# EAGLE design MB_DoorLock (EAGLE 9.0.0)
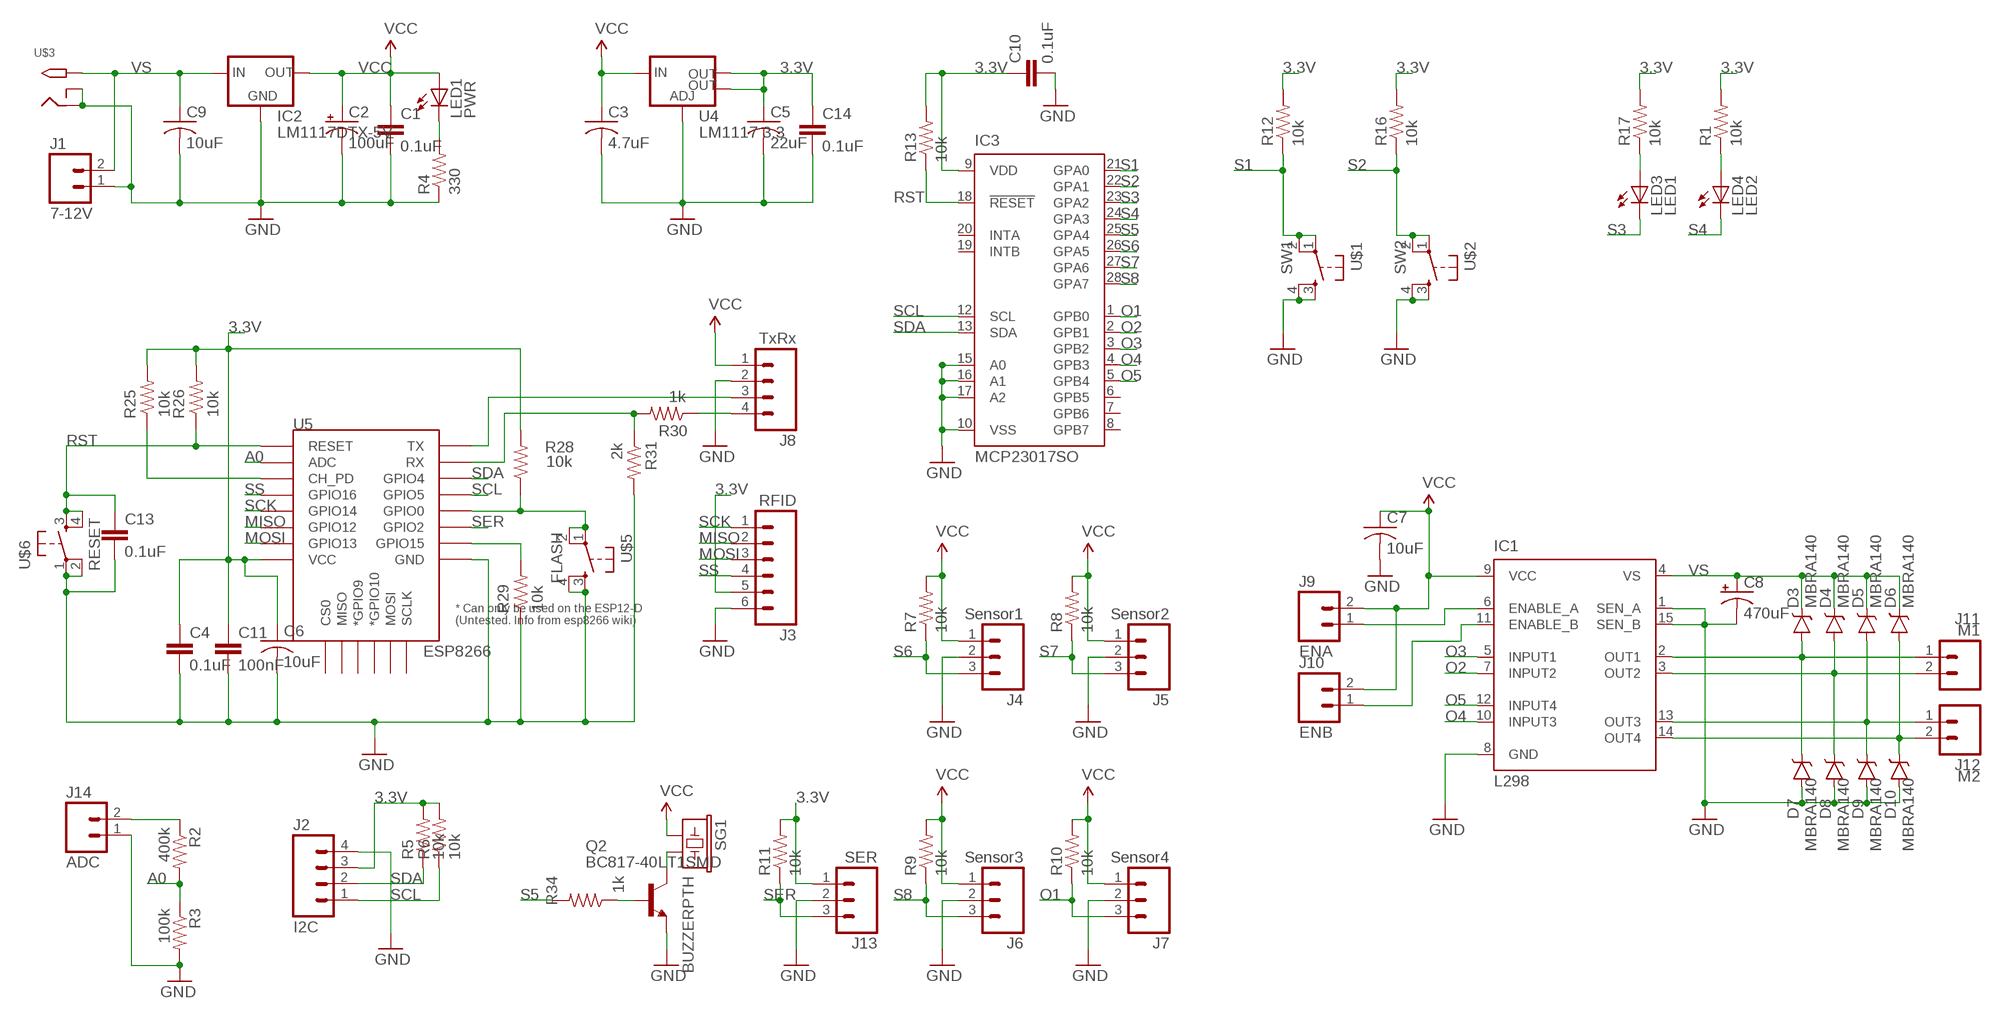
[diagram p0: schematic, sheet 1]

## Parts
C1  0.1uF  CAP0805  [0805]
C2  100uF  CAP_POL3528-KIT  [EIA3528-KIT]
C3  4.7uF  C-USC1206  [C1206]
C4  0.1uF  CAP0805  [0805]
C5  22uF  C-USC1206  [C1206]
C6  10uF  C-USC1206  [C1206]
C7  10uF  C-USC1206  [C1206]
C8  470uF  CPOL-US153CLV-1012  [153CLV-1012]
C9  10uF  C-USC1206  [C1206]
C10  0.1uF  CAP0805  [0805]
C11  100nF  CAP0805  [0805]
C13  0.1uF  CAP0805  [0805]
C14  0.1uF  CAP0805  [0805]
D3  MBRA140  [SMA-DIODE]
D4  MBRA140  [SMA-DIODE]
D5  MBRA140  [SMA-DIODE]
D6  MBRA140  [SMA-DIODE]
D7  MBRA140  [SMA-DIODE]
D8  MBRA140  [SMA-DIODE]
D9  MBRA140  [SMA-DIODE]
D10  MBRA140  [SMA-DIODE]
IC1  L298  [MULTIWATT-15]
IC2  LM1117DTX-5V  LM1117DTX-3.3  [TO252]
IC3  MCP23017SO  [SO28W]
J1  7-12V  M02POLAR  [MOLEX-1X2]
J2  I2C  M04JST-PTH-VERT  [JST-4-PTH-VERT]
J3  RFID  M06POLAR  [MOLEX-1X6]
J4  Sensor1  M03JST-PTH-VERT  [JST-3-PTH-VERT]
J5  Sensor2  M03JST-PTH-VERT  [JST-3-PTH-VERT]
J6  Sensor3  M03JST-PTH-VERT  [JST-3-PTH-VERT]
J7  Sensor4  M03JST-PTH-VERT  [JST-3-PTH-VERT]
J8  TxRx  M04POLAR  [MOLEX-1X4]
J9  ENA  M02PTH  [1X02]
J10  ENB  M02PTH  [1X02]
J11  M1  M02POLAR  [MOLEX-1X2]
J12  M2  M02POLAR  [MOLEX-1X2]
J13  SER  M03JST-PTH-VERT  [JST-3-PTH-VERT]
J14  ADC  M02POLAR  [MOLEX-1X2]
LED1  PWR  LEDCHIP-LED0805  [CHIP-LED0805]
LED3  LED1  LEDCHIP-LED0805  [CHIP-LED0805]
LED4  LED2  LEDCHIP-LED0805  [CHIP-LED0805]
Q2  BC817-40LT1SMD  [SOT23-BEC]
R1  10k  RESISTOR0805-RES  [0805]
R2  400k  RESISTOR0805-RES  [0805]
R3  100k  RESISTOR0805-RES  [0805]
R4  330  RESISTOR0805-RES  [0805]
R5  10k  RESISTOR0805-RES  [0805]
R6  10k  RESISTOR0805-RES  [0805]
R7  10k  RESISTOR0805-RES  [0805]
R8  10k  RESISTOR0805-RES  [0805]
R9  10k  RESISTOR0805-RES  [0805]
R10  10k  RESISTOR0805-RES  [0805]
R11  10k  RESISTOR0805-RES  [0805]
R12  10k  RESISTOR0805-RES  [0805]
R13  10k  RESISTOR0805-RES  [0805]
R16  10k  RESISTOR0805-RES  [0805]
R17  10k  RESISTOR0805-RES  [0805]
R25  10k  RESISTOR0805-RES  [0805]
R26  10k  RESISTOR0805-RES  [0805]
R28  10k  RESISTOR0805-RES  [0805]
R29  10k  RESISTOR0805-RES  [0805]
R30  1k  RESISTOR0805-RES  [0805]
R31  2k  RESISTOR0805-RES  [0805]
R34  1k  RESISTOR0805-RES  [0805]
SG1  BUZZERPTH  [BUZZER-12MM]
U4  LM1117 3.3  V_REG_LM1117SOT223  [SOT223]
U5  ESP8266  ESP12ESMD  [ESP12E-SMD]
U$1  SW1  TACTILE-SWITCH-PTH  [TAC-SWITCH-PTH]
U$2  SW2  TACTILE-SWITCH-PTH  [TAC-SWITCH-PTH]
U$3  7*12V  2.1MMJACK  [PJ-102A]
U$5  FLASH  TACTILE-SWITCH-PTH  [TAC-SWITCH-PTH]
U$6  RESET  TACTILE-SWITCH-PTH  [TAC-SWITCH-PTH]

## Nets
3.3V: C4.1 C5.1 C6.1 C10.1 C11.1 C14.1 IC3.9(VDD) J2.3 J3.5 J13.1 R1.2 R5.2 R6.2 R11.2 R12.2 R13.2 R16.2 R17.2 R25.2 R26.2 R28.2 U4.2(OUT) U4.4(OUT) U5.VCC
A0: R2.2 R3.1 U5.ADC
GND: C1.2 C2.C(-) C3.2 C4.2 C5.2 C6.2 C7.2 C8.- C9.2 C10.2 C11.2 C13.2 C14.2 D7.A D8.A D9.A D10.A IC1.1(SEN_A) IC1.8(GND) IC1.15(SEN_B) IC2.1(GND) IC3.10(VSS) IC3.15(A0) IC3.16(A1) IC3.17(A2) J1.1 J2.4 J3.6 J4.2 J5.2 J6.2 J7.2 J8.2 J13.2 J14.1 Q2.E R3.2 R4.1 R29.1 R31.2 U4.1(ADJ) U5.GND U$1.3 U$1.4 U$2.3 U$2.4 U$3.RING U$3.RING_SW U$5.3 U$5.4 U$6.1 U$6.2
MISO: J3.2 U5.GPIO12
MOSI: J3.3 U5.GPIO13
N$1: IC1.6(ENABLE_A) J9.1
N$2: IC1.11(ENABLE_B) J10.1
N$3: J14.2 R2.1
N$5: LED3.A R17.1
N$6: D3.A D7.C IC1.2(OUT1) J11.1
N$7: D4.A D8.C IC1.3(OUT2) J11.2
N$8: D5.A D9.C IC1.13(OUT3) J12.1
N$9: LED1.C R4.2
N$10: D6.A D10.C IC1.14(OUT4) J12.2
N$11: LED4.A R1.1
N$25: J8.4 R30.1
N$26: R30.2 R31.1 U5.RXD0(RX)
N$29: Q2.B R34.1
N$36: R25.1 U5.CH_PD
N$37: R28.1 U5.GPIO0 U$5.1 U$5.2
N$38: R29.2 U5.GPIO15
N$40: Q2.C SG1.-
N$41: J8.3 U5.TXD0(TX)
O1: IC3.1(GPB0) J7.3 R10.1
O2: IC1.7(INPUT2) IC3.2(GPB1)
O3: IC1.5(INPUT1) IC3.3(GPB2)
O4: IC1.10(INPUT3) IC3.4(GPB3)
O5: IC1.12(INPUT4) IC3.5(GPB4)
RST: C13.1 IC3.18(!RESET) R13.1 R26.1 U5.RESET U$6.3 U$6.4
S1: IC3.21(GPA0) R12.1 U$1.1 U$1.2
S2: IC3.22(GPA1) R16.1 U$2.1 U$2.2
S3: IC3.23(GPA2) LED3.C
S4: IC3.24(GPA3) LED4.C
S5: IC3.25(GPA4) R34.2
S6: IC3.26(GPA5) J4.3 R7.1
S7: IC3.27(GPA6) J5.3 R8.1
S8: IC3.28(GPA7) J6.3 R9.1
SCK: J3.1 U5.GPIO14
SCL: IC3.12(SCL) J2.1 R6.1 U5.GPIO5
SDA: IC3.13(SDA) J2.2 R5.1 U5.GPIO4
SER: J13.3 R11.1 U5.GPIO2
SS: J3.4 U5.GPIO16
VCC: C1.1 C2.A(+) C3.1 C7.1 IC1.9(VCC) IC2.TAB(OUT) J4.1 J5.1 J6.1 J7.1 J8.1 J9.2 J10.2 LED1.A R7.2 R8.2 R9.2 R10.2 SG1.+ U4.3(IN)
VS: C8.+ C9.1 D3.C D4.C D5.C D6.C IC1.4(VS) IC2.2(IN) J1.2 U$3.TIP
Unconnected: IC3.6(GPB5) IC3.7(GPB6) IC3.8(GPB7) IC3.19(INTB) IC3.20(INTA) U5.CS0 U5.GPIO9(*GPIO9) U5.GPIO10(*GPIO10) U5.MISO U5.MOSI U5.SCLK

## Library data of the parts
C1 C4 C10 C11 C13 C14 = SparkFun-Passives:CAP: Capacitor Standard 0603 ceramic capacitor, and 0.1" leaded capacitor.
C2 = SparkFun-Passives:CAP_POL: Capacitor Polarized These are standard SMD and PTH capacitors. Normally 10uF, 47uF, and 100uF in electrolytic and tantalum varieties. Always verify the external diameter of the through hole cap, it varies with capacity, voltage, and manufacturer. The EIA devices should be standard.
C3 C5-C7 C9 = adafruit:C-US: CAPACITOR, American symbol
C8 = adafruit:CPOL-US: POLARIZED CAPACITOR, American symbol
D3-D10 = SparkFun-DiscreteSemi:MBRA140: 40V, 1A Schottky rectifier SMA/DO-214AC package DIO-08053; PROD_ID: DIO-08053
IC1 = L298(new):L298: DUAL FULL-BRIDGE DRIVER
IC2 = lm1117:LM1117DTX-*
IC3 = microchip:MCP23017: http://ww1.microchip.com/downloads/en/DeviceDoc/21952a.pdf Source: http://ww1.microchip.com/downloads/en/DeviceDoc/21952a.pdf; MF: MICROCHIP; MPN: MCP23017-E/SO; OC_FARNELL: 1332087; OC_NEWARK: 31K2958
J1 J9-J12 J14 = SparkFun-Connectors:M02: Standard 2-pin 0.1" header. Use with - straight break away headers ( PRT-00116) - right angle break away headers (PRT-00553) - swiss pins (PRT-00743) - machine pins (PRT-00117) - female headers (PRT-00115) Molex polarized connector foot print use with: PRT-08233 with associated crimp pins and housings. 2.54_SCREWTERM for use with PRT-10571. 3.5mm Screw Terminal footprints for PRT-08084 5mm Screw Terminal footprints for use with PRT-08432
J2 = SparkFun-Connectors:M04: Header 4 Standard 4-pin 0.1" header. Use with straight break away headers (SKU : PRT-00116), right angle break away headers (PRT-00553), swiss pins (PRT-00743), machine pins (PRT-00117), and female headers (PRT-00115). Molex polarized connector foot print use with SKU : PRT-08231 with associated crimp pins and housings. 1MM SMD Version SKU: PRT-10208; PROD_ID: CONN-13251
J3 = SparkFun-Connectors:M06: Header 6 Standard 6-pin 0.1" header. Use with straight break away headers (SKU : PRT-00116), right angle break away headers (PRT-00553), swiss pins (PRT-00743), machine pins (PRT-00117), and female headers (PRT-00115). Molex polarized connector foot print use with SKU : PRT-08094 with associated crimp pins and housings. NOTES ON THE VARIANTS LOCK and LOCK_LONGPADS... This footprint was designed to help hold the alignment of a through-hole component (i.e. 6-pin header) while soldering it into place. You may notice that each hole has been shifted either up or down by 0.005 of an inch from it's more standard position (which is a perfectly straight line). This slight alteration caused the pins (the squares in the middle) to touch the edges of the holes. Because they are alternating, it causes a "brace" to hold the component in place. 0.005 has proven to be the perfect amount of "off-center" position when using our standard breakaway headers. Although looks a little odd when you look at the bare footprint, once you have a header in there, the alteration is very hard to notice. Also,if you push a header all the way into place, it is covered up entirely on the bottom side. This idea of altering the position of holes to aid alignment will be further integrated into the Sparkfun Library for other footprints. It can help hold any component with 3 or more connection pins.
J4-J7 J13 = ES-CONNECTOR:M03: Header 3 Standard 3-pin 0.1" header. Use with straight break away headers (SKU : PRT-00116), right angle break away headers (PRT-00553), swiss pins (PRT-00743), machine pins (PRT-00117), and female headers (PRT-00115). Molex polarized connector foot print use with SKU : PRT-08232 with associated crimp pins and housings.
J8 = SparkFun-Connectors:M04: Header 4 Standard 4-pin 0.1" header. Use with straight break away headers (SKU : PRT-00116), right angle break away headers (PRT-00553), swiss pins (PRT-00743), machine pins (PRT-00117), and female headers (PRT-00115). Molex polarized connector foot print use with SKU : PRT-08231 with associated crimp pins and housings. 1MM SMD Version SKU: PRT-10208
LED1 LED3 LED4 = adafruit:LED: LED OSRAM: - CHIPLED LG R971, LG N971, LY N971, LG Q971, LY Q971, LO R971, LY R971 LH N974, LH R974 LS Q976, LO Q976, LY Q976 LO Q996 - Hyper CHIPLED LW Q18S LB Q993, LB Q99A, LB R99A - SideLED LS A670, LO A670, LY A670, LG A670, LP A670 LB A673, LV A673, LT A673, LW A673 LH A674 LY A675 LS A676, LA A676, LO A676, LY A676, LW A676 LS A679, LY A679, LG A679 - Hyper Micro SIDELED® LS Y876, LA Y876, LO Y876, LY Y876 LT Y87S - SmartLED LW L88C, LW L88S LB L89C, LB L89S, LG L890 LS L89K, LO L89K, LY L89K LS L896, LA L896, LO L896, LY L896 - TOPLED LS T670, LO T670, LY T670, LG T670, LP T670 LSG T670, LSP T670, LSY T670, LOP T670, LYG T670 LG T671, LOG T671, LSG T671 LB T673, LV T673, LT T673, LW T673 LH T674 LS T676, LA T676, LO T676, LY T676, LB T676, LH T676, LSB T676, LW T676 LB T67C, LV T67C, LT T67C, LS T67K, LO T67K, LY T67K, LW E67C LS E67B, LA E67B, LO E67B, LY E67B, LB E67C, LV E67C, LT E67C LW T67C LS T679, LY T679, LG T679 LS T770, LO T770, LY T770, LG T770, LP T770 LB T773, LV T773, LT T773, LW T773 LH T774 LS E675, LA E675, LY E675, LS T675 LS T776, LA T776, LO T776, LY T776, LB T776 LHGB T686 LT T68C, LB T68C - Hyper Mini TOPLED® LB M676 - Mini TOPLED Santana® LG M470 LS M47K, LO M47K, LY M47K Source: http://www.osram.convergy.de/
Q2 = transistor-npn:BC817*: NPN Transistor
R1-R13 R16 R17 R25 R26 R28-R31 R34 = SparkFun-Resistors:RESISTOR: Resistor Basic schematic elements and footprints for 0603, 1206, and PTH resistors.
SG1 = SparkFun-Electromechanical:BUZZER: Buzzer 12mm Spark Fun Electronics SKU : Comp-Buzzer
U4 = SparkFun-PowerIC:V_REG_LM1117: Voltage Regulator LM1117 Standard adjustable voltage regulator but in SMD form. Spark Fun Electronics SKU : COM-00595; PROD_ID: VREG-08170
U5 = esp8266modules:ESP12E: ESP12E Module
U$1 U$2 U$5 U$6 = GeekAmmo:TACTILE-SWITCH: Tactile Switch 4 Pins, SPST NO
U$3 = adafruit:2.1MMJACK: 2.1mm x 5.5mm DC jack with internal switch. Digikey part #PJ-102A, 4UCON part #05537 By microbuilder.eu

## Board
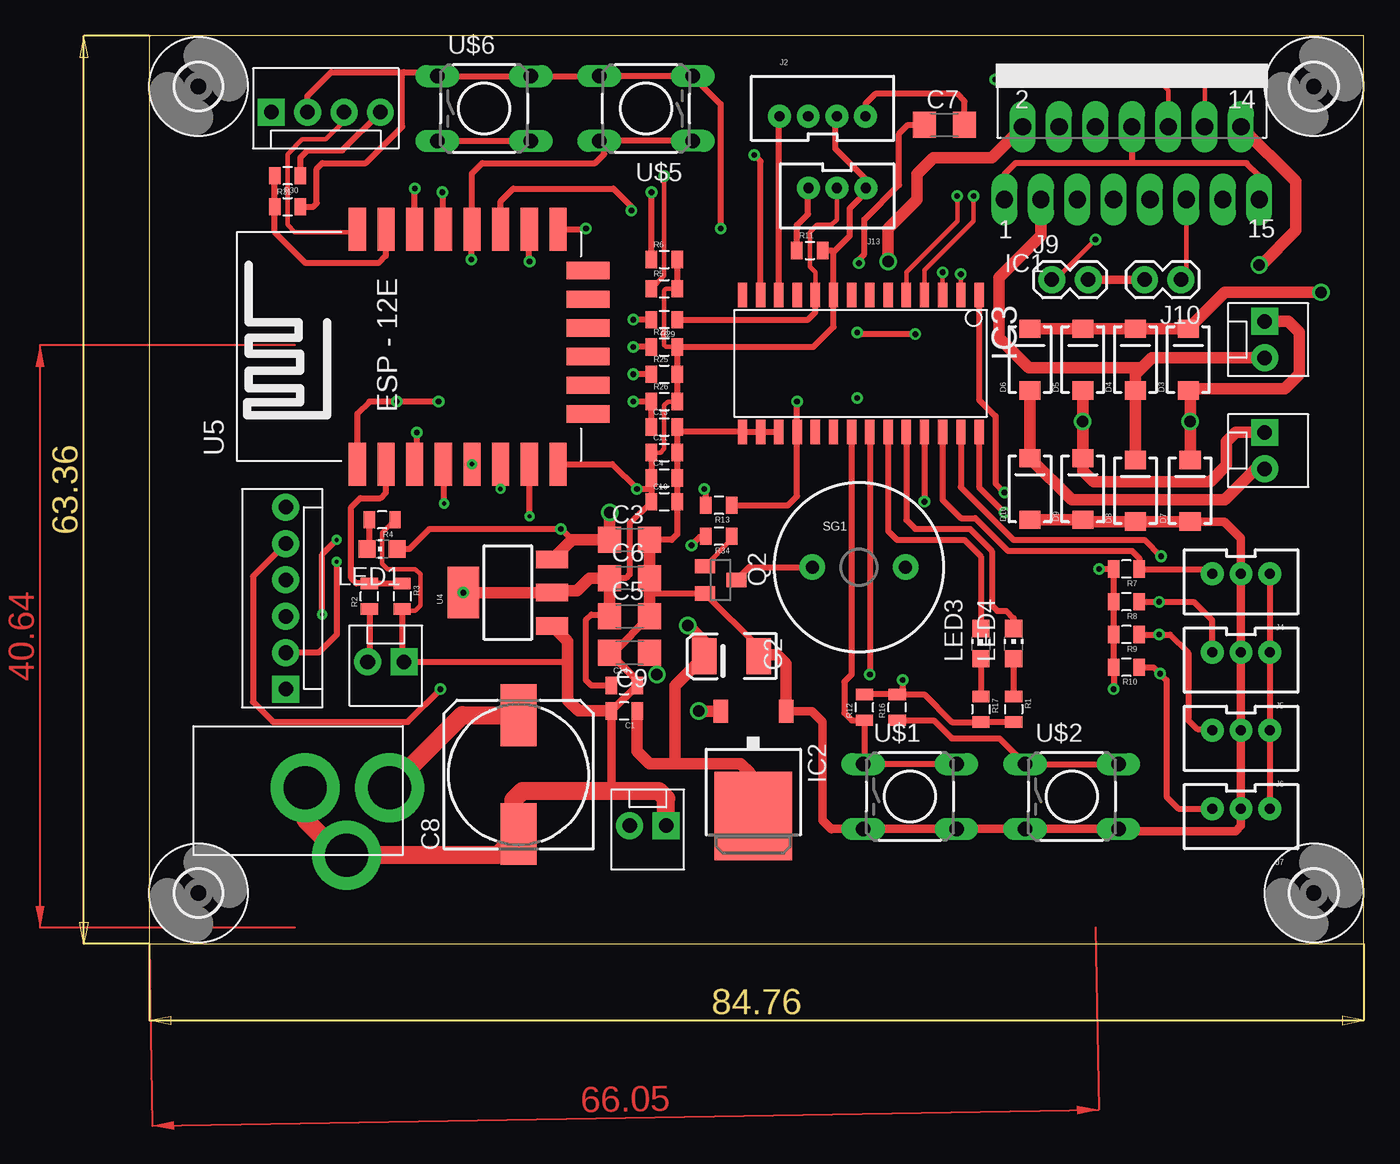
[diagram p1: board, top side]
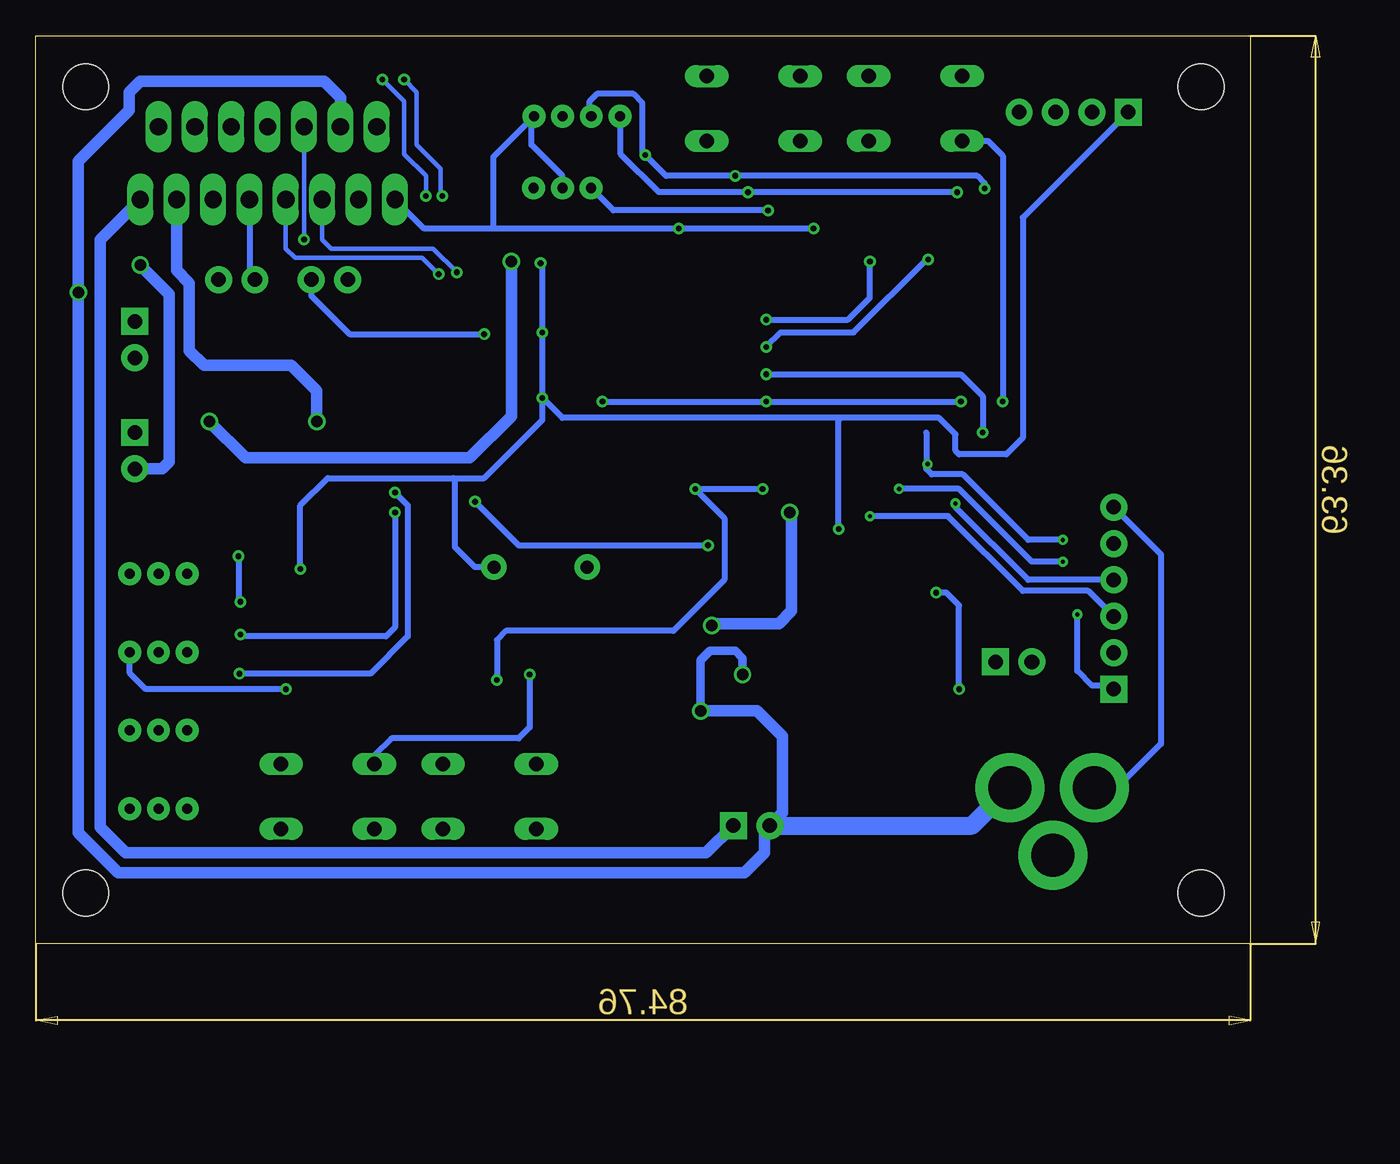
[diagram p2: board, bottom side, seen from below]

Size 84.76 x 63.36 mm. Coordinates in mm from the lower left corner, seen from the top.
Outline: 0,0 84.76,0 84.76,63.36 0,63.36 0,0
Copper layers (1*16): Top 0.035mm / dielectric 1.5mm / Bottom 0.035mm
Design rules "default *": minimum track width 6mil, minimum drill 0.35mm, track to track 6mil, track to pad 6mil, pad to pad 6mil, via to via 6mil, smd to smd 6mil, copper to edge 40mil, drill to drill 6mil, minimum pad ring 10mil, minimum via ring 8mil, stop-mask expansion 4mil, vias tented up to drill 25mil, thermal gap 10mil

### Footprints (pad centres in the part's own frame; a part is rotated, then mirrored left to right if it is on the bottom)
0805 = smd 0.8 x 1.2: 1 -0.9,0; 2 0.9,0
EIA3528-KIT = smd 1.7 x 2.5: A 1.9,0; C -1.9,0
C1206 = smd 1.6 x 1.8: 1 -1.4,0; 2 1.4,0
153CLV-1012 = smd 4.3 x 2.5: + 4.15,0; - -4.15,0
SMA-DIODE = smd 1.27 x 1.47: A -2.15,0; C 2.15,0
MULTIWATT-15 = drill 1.2 long: 1 -8.89,-7.62; 2 -7.62,-2.54; 3 -6.35,-7.62; 4 -5.08,-2.54; 5 -3.81,-7.62; 6 -2.54,-2.54; 7 -1.27,-7.62; 8 0,-2.54; 9 1.27,-7.62; 10 2.54,-2.54; 11 3.81,-7.62; 12 5.08,-2.54; 13 6.35,-7.62; 14 7.62,-2.54; 15 8.89,-7.62
TO252 = smd 1 x 1.6: 1 -2.28,-4.8; 2 2.28,-4.8 | smd 5.4 x 6.2: TAB 0,2.5
SO28W = smd 0.65 x 1.7: 1 -7.62,-4.78; 2 -6.35,-4.78; 3 -5.08,-4.78; 4 -3.81,-4.78; 5 -2.54,-4.78; 6 -1.27,-4.78; 7 0,-4.78; 8 1.27,-4.78; 9 2.54,-4.78; 10 3.81,-4.78; 11 5.08,-4.78; 12 6.35,-4.78; 13 7.62,-4.78; 14 8.89,-4.78; 15 8.89,4.78; 16 7.62,4.78; 17 6.35,4.78; 18 5.08,4.78; 19 3.81,4.78; 20 2.54,4.78; 21 1.27,4.78; 22 0,4.78; 23 -1.27,4.78; 24 -2.54,4.78; 25 -3.81,4.78; 26 -5.08,4.78; 27 -6.35,4.78; 28 -7.62,4.78
MOLEX-1X2 = drill 1.016 pad 1.88 square: 1 0,0 | drill 1.016 pad 1.88: 2 2.54,0
JST-4-PTH-VERT = drill 0.7 pad 1.6: 1 -3,-0.55; 2 -1,-0.55; 3 1,-0.55; 4 3,-0.55
MOLEX-1X6 = drill 1.016 pad 1.88 square: 1 0,0 | drill 1.016 pad 1.88: 2 2.54,0; 3 5.08,0; 4 7.62,0; 5 10.16,0; 6 12.7,0
JST-3-PTH-VERT = drill 0.7 pad 1.6: 1 -2,-0.55; 2 0,-0.55; 3 2,-0.55
MOLEX-1X4 = drill 1.016 pad 1.88 square: 1 0,0 | drill 1.016 pad 1.88: 2 2.54,0; 3 5.08,0; 4 7.62,0
1X02 = drill 1.016 pad 1.88: 1 0,0; 2 2.54,0
CHIP-LED0805 = smd 1.2 x 1.2: A 0,-1.05; C 0,1.05
SOT23-BEC = smd 1 x 1.4: B -0.95,-1.1; C 0,1.1; E 0.95,-1.1
BUZZER-12MM = drill 0.9 pad 1.778: + 3.25,0; - -3.25,0
SOT223 = smd 1.219 x 2.235: 1 -2.311,-3.099; 2 0,-3.099; 3 2.311,-3.099 | smd 3.6 x 2.2: 4 0,3.099
ESP12E-SMD = smd 3 x 1.2: ADC -8.3,3.8; CH_PD -8.3,1.8; GND 8.1,-8.2; GPIO0 8.1,-2.2; GPIO2 8.1,-4.2; GPIO4 8.1,1.8; GPIO5 8.1,-0.2; GPIO12 -8.3,-4.2; GPIO13 -8.3,-6.2; GPIO14 -8.3,-2.2; GPIO15 8.1,-6.2; GPIO16 -8.3,-0.2; RESET -8.3,5.8; RXD0 8.1,3.8; TXD0 8.1,5.8; VCC -8.3,-8.2 | smd 1.2 x 3: CS0 -4.8,-10.3; GPIO9 -0.8,-10.3; GPIO10 1.2,-10.3; MISO -2.8,-10.3; MOSI 3.2,-10.3; SCLK 5.2,-10.3
TAC-SWITCH-PTH = drill 1.016 pad 1.524 long: 1 -3.251,2.261; 2 3.251,2.261; 3 -3.251,-2.261; 4 3.251,-2.261
PJ-102A = drill 3 pad 4.8: RING 0.1,-3.39; RING_SW -4.6,-6.29; TIP 0.1,-9.29
3,2 = hole 3.2: 0,0

### Placement (x,y rotation side)
C1  33.15,16.26 180 top
C2  40.64,20.07 180 top
C3  33.53,28.19 0 top
C4  35.94,32.51 0 top
C5  33.53,22.86 0 top
C6  33.53,25.53 0 top
C7  55.5,57.15 0 top
C8  25.78,11.81 90 top
C9  33.53,20.32 180 top
C10  35.94,30.86 0 top
C11  35.94,34.29 0 top
C13  35.94,36.07 0 top
C14  33.15,18.03 0 top
D3  72.52,40.77 90 top
D4  68.83,40.77 90 top
D5  65.15,40.77 90 top
D6  61.47,40.77 90 top
D7  72.64,31.62 90 top
D8  68.83,31.62 90 top
D9  65.15,31.75 90 top
D10  61.47,31.75 90 top
IC1  68.58,59.56 0 top
IC2  42.16,11.43 180 top
IC3  50.29,40.51 180 top
J1  36.07,8.26 180 top
J2  46.99,58.29 0 top
J3  9.53,17.78 90 top
J4  76.2,25.27 180 top
J5  76.2,19.81 180 top
J6  76.2,14.35 180 top
J7  76.2,8.89 180 top
J8  8.51,58.04 0 top
J9  62.99,46.36 0 top
J10  72.01,46.36 180 top
J11  77.85,43.43 270 top
J12  77.85,35.69 270 top
J13  48.01,52.2 180 top
J14  17.78,19.68 180 top
LED1  16.26,27.56 90 top
LED3  58.04,20.95 0 top
LED4  60.33,20.95 0 top
Q2  39.88,25.4 270 top
R1  60.33,16.38 270 top
R2  15.37,24.26 90 top
R3  17.65,24.26 270 top
R4  16.26,29.59 180 top
R5  35.94,45.72 0 top
R6  35.94,47.75 0 top
R7  68.2,26.16 180 top
R8  68.2,23.88 180 top
R9  68.2,21.59 180 top
R10  68.2,19.3 180 top
R11  46.1,48.39 0 top
R12  49.91,16.51 90 top
R13  39.75,30.61 180 top
R16  52.2,16.51 90 top
R17  58.04,16.38 270 top
R25  35.94,39.75 0 top
R26  35.94,37.85 0 top
R28  35.94,41.66 0 top
R29  35.94,43.56 180 top
R30  9.65,53.59 180 top
R31  9.65,51.44 0 top
R34  39.75,28.45 180 top
SG1  49.53,26.29 0 top
U4  25.02,24.51 90 top
U5  20.32,41.78 90 top
U$1  53.09,10.29 0 top
U$2  64.39,10.29 0 top
U$3  7.49,10.79 90 top
U$4  [3,2]  3.43,3.56 0 top
U$5  34.67,58.29 180 top
U$6  23.37,58.29 0 top
U$7  [3,2]  3.43,59.82 0 top
U$8  [3,2]  81.28,59.82 0 top
U$9  [3,2]  81.28,3.56 0 top

### Tracks (layer width: path | path; a pad name or v marks a point on that pad's centre or on a via)
3.3V  (via drill 0.4)
  Top 0.305: R5.2 36.07,45.72 35.94,45.59 35.94,41.78 36.07,41.66 R28.2 | C11.1 35.69,34.29 35.94,34.54 35.94,37.59 36.2,37.85 R26.2
  Top 0.406: R1.2 R17.2 56.02,15.48 54.09,17.41 52.58,17.41 | R12.2 R16.2 52.58,17.41 | R6.2 R5.2 | R26.2 R25.2 R28.2 46.35,41.66 47.75,43.05 IC3.9 47.75,48.26 | C11.1 C4.1 35.04,31.88 | 35.04,31.88 C10.1 33.53,29.35 33.53,25.78 33.27,25.53 C6.1 | C14.1 30.86,18.03 30.48,18.41 30.48,22.61 30.86,22.99 32.13,22.99 | J2.3 47.88,57.63 47.88,55.5 50.01,53.37 J13.1 50.16,52.59 48.9,51.32 48.9,49.4 47.75,48.26 | R11.2 47.62,48.39 47.75,48.26 | R13.2 38.85,31.63 v38.73,31.75 | 35.04,31.88 34.91,31.75 v34.04,31.75 32.3,33.48 U5.VCC | J3.5 7.24,25.65 7.24,16.89 8.64,15.49 18.03,15.49 v20.32,17.78 | v52.58,18.41 52.58,17.41
  Top 0.813: C5.1 32.13,22.99 C6.1 30.73,25.53 29.84,24.64 28.25,24.64 U4.2 U4.4
  Bottom 0.406: v34.04,31.75 v38.73,31.75 36.7,29.72 36.7,25.4 40.26,21.84 51.94,21.84 52.58,21.21 v52.58,18.41 | v20.32,17.78 20.32,23.62 21.21,24.51 U4.4
  other vias: 21.92,24.51
A0
  Top 0.406: R3.1 R2.2 14.47,25.16 14.1,25.53 14.1,30.48 14.73,31.11 16.13,31.11 16.52,31.51 U5.ADC
GND  (via drill 0.4)
  Top 0.305: R4.1 16.26,28.69 16.26,26.54 16.64,26.16 18.54,26.16 18.92,25.78 18.92,23.62 18.54,23.24 17.78,23.24 17.65,23.11 | IC3.10 46.48,46.86 46.1,47.24 46.1,49.66 46.61,50.16 47.62,50.16 48.01,50.55 J13.2
  Top 0.406: 50.04,8.03 U$1.3 | U$6.1 20.32,60.55 | 20.32,60.55 U$6.2 U$5.4 U$5.3 39.88,58.6 v39.88,49.91 | J8.2 11.05,59.18 12.7,60.83 17.78,60.83 | 17.78,60.83 20.32,60.83 20.32,60.55 | R3.2 17.65,23.11 17.65,19.81 J14.1 29.21,19.68 | C13.2 36.84,35.69 | 36.84,35.69 C11.2 C4.2 C10.2 36.84,28.59 36.45,28.19 C3.2 | IC3.17 IC3.16 IC3.15 36.89,35.73 36.84,35.69 | R31.2 11.43,51.44 11.68,51.69 11.68,54.1 12.06,54.48 15.11,54.48 17.65,57.02 17.65,60.71 17.78,60.83 | 34.93,24.26 35.12,24.45 Q2.E 42.54,20.69 C2.C | R29.1 45.97,43.56 46.48,44.07 IC3.10 | U5.GND 30.45,49.88 v30.48,49.91 | IC1.15 77.47,53.59 76.58,54.48 68.58,54.48 | 68.58,54.48 60.45,54.48 59.69,53.72 IC1.1 | IC1.8 68.58,54.48 | C7.2 56.9,58.8 56.39,59.31 50.67,59.31 49.99,58.63 J2.4 | U$3.RING_SW 13.76,6.22 12.7,6.22 13.02,6.54
  Top 0.508: C5.2 32.39,20.32 C9.2 34.05,18.4 C14.2 34.02,18.03 C1.2
  Top 0.61: C1.2 32.25,11.06 32.64,10.67 | IC2.1 46.25,16.23 46.99,15.49 46.99,8.64 47.62,8 47.65,8.03 50.04,8.03 | U$1.3 U$1.4 U$2.3 U$2.4 67.79,7.87 75.82,7.87 76.2,8.26 J7.2 J6.2 J5.2 J4.2 76.2,28.32 75.05,29.47 D7.A
  Top 0.813: D7.A D8.A 65.28,29.47 D9.A D10.A | C3.2 C6.2 34.93,24.26 C5.2 | U4.1 29.21,21.11 29.21,19.68 29.21,17.02 29.97,16.26 C1.2 | IC2.1 44.44,19.56 43.81,20.19 43.18,20.19 42.55,20.83 42.54,20.82 C2.C
  Top 1.27: U$3.RING 10.88,8.68 13.02,6.54 13.34,6.22 | U$3.RING_SW 24.32,6.2 C8.- 25.4,8.04 25.4,10.03 26.04,10.67 32.64,10.67 35.56,10.67 36.07,10.16 J1.1
  Bottom 0.406: J13.2 48.01,53.59 50.16,55.75 50.16,57.57 J2.4 52.83,54.9 52.83,49.91 | v30.48,49.91 v39.88,49.91 52.83,49.91 | 52.83,49.91 57.66,49.91 IC1.1 | J3.6 6.22,27.18 6.22,13.97 9.3,10.9 U$3.RING
  Bottom 0.813: J1.1 37.97,6.35 78.49,6.35 80.26,8.13 80.26,49.15 IC1.15
MISO  (via drill 0.3)
  Top 0.406: v24.51,31.75 U5.GPIO12 | J3.2 11.81,20.32 13.08,21.59 v13.08,26.67
  Bottom 0.406: v13.08,26.67 15.24,26.67 20.32,31.75 v24.51,31.75
MOSI  (via drill 0.3)
  Top 0.406: v26.54,29.84 26.54,33.46 U5.GPIO13
  Bottom 0.406: J3.3 11.3,24.64 15.88,24.64 21.08,29.84 v26.54,29.84
N$1  (via drill 0.4)
  Top 0.305: v66.04,49.15 63.25,46.36 J9.1
  Bottom 0.305: IC1.6 v66.04,49.15
N$2
  Top 0.305: IC1.11 72.39,46.74 J10.1
N$3
  Top 0.406: R2.1 15.37,19.81 J14.2
N$5
  Top 0.406: LED3.A R17.1
N$6  (via drill 0.8)
  Top 0.813: D7.C v72.64,36.45 72.64,38.49 D3.A 72.64,38.73 79.25,38.73 80.26,39.75 80.26,42.67 79.5,43.43 J11.1 | v51.56,47.62 51.56,49.91 53.59,51.94 53.59,53.72 54.74,54.86 58.8,54.86 IC1.2
  Bottom 0.813: v51.56,47.62 51.56,36.83 54.48,33.91 70.1,33.91 v72.64,36.45
N$7
  Top 0.813: D8.C D4.A 68.83,39.75 69.28,40.2 | J11.2 69.98,40.89 69.28,40.2 | IC1.3 62.23,49.4 59.31,46.48 59.31,42.29 61.4,40.2 69.28,40.2
N$8  (via drill 0.8)
  Top 0.813: D5.A v65.15,36.45 D9.C 65.15,33.02 65.91,32.26 74.04,32.26 75.18,33.4 75.18,35.05 75.82,35.69 J12.1
  Bottom 0.813: IC1.13 74.93,46.99 74.04,46.1 74.04,41.4 73.03,40.39 66.93,40.39 D5.A v65.15,36.45
N$9
  Top 0.406: R4.2 15.36,27.71 LED1.C
N$10  (via drill 0.8)
  Top 0.813: D6.A D10.C 64.38,30.99 75.06,30.99 77.22,33.15 J12.2 | IC1.14 80.01,53.21 80.01,49.78 77.6,47.37 v77.47,47.37
  Bottom 0.813: v77.47,47.37 75.44,45.34 75.44,33.66 75.95,33.15 J12.2
N$11
  Top 0.406: LED4.A R1.1
N$25
  Top 0.406: R30.1 10.55,54.88 11.05,55.37 13.46,55.37 J8.4
N$26
  Top 0.406: R30.2 R31.1 8.75,49.67 10.92,47.5 16,47.5 16.51,48.01 U5.RXD0
N$29
  Top 0.305: Q2.B 40.65,28.22 R34.1
N$36  (via drill 0.4)
  Top 0.406: R25.1 v33.78,39.75 | v18.67,35.69 18.67,33.63 U5.CH_PD
  Bottom 0.406: v33.78,39.75 20.19,39.75 18.67,38.23 v18.67,35.69
N$37  (via drill 0.4)
  Top 0.406: U$5.1 31.75,56.03 | 31.75,56.03 U$5.2 | 31.75,56.03 31.75,55.12 31.11,54.48 23.24,54.48 22.52,53.76 U5.GPIO0 22.48,49.84 v22.48,47.75 | R28.1 v33.78,41.66
  Bottom 0.406: v33.78,41.66 32.77,42.67 27.69,42.67 22.61,47.75 v22.48,47.75
N$38  (via drill 0.4)
  Top 0.406: R29.2 v33.78,43.56 | v26.54,47.62 26.52,47.65 U5.GPIO15
  Bottom 0.406: v33.78,43.56 28.07,43.56 26.54,45.09 v26.54,47.62
N$40
  Top 0.406: Q2.C 41.87,26.29 SG1.-
N$41
  Top 0.305: J8.3 13.59,57.4 12.32,56.13 10.67,56.13 9.65,55.12 9.65,50.16 10.16,49.66 14.29,49.66
  Top 0.406: 14.29,49.66 U5.TXD0
O1  (via drill 0.4)
  Top 0.406: R10.1 70.1,19.3 v70.55,18.86 70.99,18.41 70.99,10.29 71.84,9.44 J7.3 | IC3.1 57.91,37.97 59.05,36.83 59.05,32.13 v59.69,31.5
  Bottom 0.406: v59.69,31.5 58.8,30.61 58.8,21.46 61.4,18.86 v70.55,18.86
O2  (via drill 0.4)
  Top 0.305: IC3.2 v56.64,46.74
  Bottom 0.305: v56.64,46.74 57.78,47.88 66.67,47.88 67.31,48.51 IC1.7
O3  (via drill 0.4)
  Top 0.305: IC3.3 v55.37,46.86
  Top 0.406: 64.64,51.82 IC1.5
  Bottom 0.305: v55.37,46.86 57.02,48.51 64.14,48.51 64.77,49.15 IC1.5
O4  (via drill 0.4)
  Top 0.305: IC3.4 54.1,46.99 57.53,50.42 v57.53,52.2 | v60.58,60.33 70.36,60.33 71.12,59.56 IC1.10
  Bottom 0.305: v57.53,52.2 57.53,53.59 59.05,55.12 59.05,58.8 v60.58,60.33
O5  (via drill 0.4)
  Top 0.305: IC3.5 52.83,46.86 56.39,50.42 v56.39,52.2 | v59.05,60.33 59.94,61.21 72.39,61.21 73.66,59.94 IC1.12
  Bottom 0.305: v56.39,52.2 56.52,52.32 56.52,54.1 58.17,55.75 58.17,59.44 v59.05,60.33
RST  (via drill 0.4)
  Top 0.406: U$6.3 U$6.4 | C13.1 R26.1 v33.78,37.85 | R13.1 44.58,30.61 45.21,31.24 IC3.18 v45.21,37.85 | v20.19,37.85 v17.27,37.85 15.37,37.85 14.52,37 U5.RESET
  Bottom 0.406: v20.19,37.85 v33.78,37.85 v45.21,37.85 | U$6.3 18.31,56.03 17.27,54.99 v17.27,37.85
S1
  Top 0.406: U$1.2 49.91,12.55 | 49.91,12.55 U$1.1 | 49.91,12.55 R12.1 49.03,15.61 48.51,16.13 48.51,18.29 49.02,18.8 IC3.21
S2  (via drill 0.4)
  Top 0.406: U$2.2 U$2.1 59.33,14.35 56.01,14.35 54.75,15.61 R16.1 | IC3.22 v50.29,18.8
  Bottom 0.406: v50.29,18.8 50.29,15.11 51.05,14.35 59.94,14.35 61.14,13.16 U$2.1
S3
  Top 0.406: IC3.23 51.56,28.83 52.2,28.19 56.9,28.19 58.04,27.05 LED3.C
S4
  Top 0.406: IC3.24 52.83,29.59 53.47,28.96 57.28,28.96 58.8,27.43 58.8,23.62 59.18,23.24 59.82,23.24 60.33,22.73 LED4.C
S5  (via drill 0.4)
  Top 0.406: IC3.25 v54.1,30.86 | v37.85,27.81 38.48,28.45 R34.2
  Bottom 0.406: v54.1,30.86 51.05,27.81 v37.85,27.81
S6
  Top 0.406: J4.3 73.86,26.16 R7.1 69.09,26.17 69.09,26.92 68.58,27.43 59.94,27.43 57.66,29.72 56.64,29.72 55.37,30.99 IC3.26
S7  (via drill 0.4)
  Top 0.406: R8.1 v70.48,23.88 72.9,23.88 74.17,22.61 74.17,20.39 J5.3 | IC3.27 56.64,31.88 60.33,28.19 69.47,28.19 v70.61,27.05
  Bottom 0.406: v70.48,23.88 70.61,23.88 v70.61,27.05
S8  (via drill 0.4)
  Top 0.406: R9.1 v70.48,21.59 71.25,21.59 72.52,20.32 72.52,15.62 73.15,14.99 74.11,14.99 J6.3 | IC3.28 57.91,31.88 v59.69,30.1
  Bottom 0.406: v59.69,30.1 59.69,22.1 60.33,21.46 70.36,21.46 v70.48,21.59
SCK  (via drill 0.3)
  Top 0.406: v12.06,22.99 12.06,27.18 v13.08,28.19
  Bottom 0.406: J3.1 9.78,18.03 11.05,18.03 12.06,19.05 v12.06,22.99 | v13.08,28.19 15.49,28.19 20.07,32.77 22.23,32.77 22.61,33.15 22.61,33.57 | 22.61,35.69 22.61,33.57 | 22.61,33.57 U5.GPIO14
  other vias: 22.52,33.48
SCL  (via drill 0.4)
  Top 0.406: U5.GPIO5 20.52,52.38 v20.45,52.45 | IC3.12 43.94,57.7 J2.1 | R6.1 35.04,52.44 v35.05,52.45
  Bottom 0.406: v20.45,52.45 v35.05,52.45 41.27,52.45 43.94,55.12 43.94,57.7 J2.1
SDA  (via drill 0.4)
  Top 0.305: R5.1 35.94,46.62 v35.94,53.59
  Top 0.406: U5.GPIO4 18.52,52.68 v18.54,52.71 | IC3.13 42.67,54.61 v42.23,55.05
  Bottom 0.406: v18.54,52.71 18.54,53.09 19.05,53.59 v35.94,53.59 40.77,53.59 v42.23,55.05 42.42,55.25 42.42,58.67 43.05,59.31 45.59,59.31 46.1,58.8 46.1,57.85 J2.2
SER  (via drill 0.4)
  Top 0.406: R11.1 45.2,50.15 45.97,50.93 45.97,52.72 J13.3 | U5.GPIO2 24.52,51.83 25.4,52.71 32.38,52.71 33.66,51.44 v33.66,51.18
  Bottom 0.406: v33.66,51.18 44.44,51.18 J13.3
SS  (via drill 0.3)
  Top 0.406: v20.57,30.73 20.57,33.43 U5.GPIO16
  Bottom 0.406: J3.4 15.49,25.4 20.57,30.48 v20.57,30.73
VCC  (via drill 0.4, 0.8)
  Top 0.406: J4.1 J5.1 J6.1 J7.1 | LED1.A 18.16,27.56 19.56,28.96 v28.73,28.96 29.49,28.19 | v66.29,26.16 R7.2 R8.2 R9.2 R10.2 v67.31,17.78 | v53.47,42.55 49.53,42.55 v49.4,42.67 | v49.53,47.5 49.53,47.75 49.91,48.13 49.91,50.55 52.32,52.96 52.32,56.52 52.96,57.15 C7.1
  Top 0.61: J10.2 J9.2
  Top 0.813: U4.3 29.49,28.19 31.88,28.19 | 31.88,28.19 C3.1 | C1.1 34.05,13.45 34.92,12.57 36.7,12.57 | 36.7,12.57 41.27,12.57 41.91,11.94 41.91,9.4 41.27,8.76 41.91,8.76 42.16,8.51 | 42.55,8.13 42.16,8.51 | 42.16,8.51 IC2.TAB | 36.7,12.57 36.7,18.03 C2.A 38.74,21.08 v37.59,22.22 | v32.13,30.1 32.13,28.45 31.88,28.19
  Bottom 0.406: IC1.9 69.85,46.74 J10.2 | v66.29,26.16 66.29,30.61 64.39,32.51 55.63,32.51 | v49.4,38.1 49.4,36.58 53.47,32.51 55.63,32.51 | v49.4,38.1 v49.4,42.67 49.4,47.37 v49.53,47.5 | J9.2 65.53,45.21 62.87,42.55 v53.47,42.55 | J8.1 15.88,50.67 15.88,35.31 17.02,34.16 20.32,34.16 20.57,34.42 20.57,35.56 21.72,36.7 28.57,36.7 | v49.4,38.1 48.01,36.7 28.57,36.7 | v28.73,28.96 28.73,36.55 28.57,36.7 | SG1.+ 54.1,26.29 55.5,27.69 55.5,32.39 55.63,32.51 | v67.31,17.78 77.09,17.78 78.2,18.89 J5.1
  Bottom 0.813: v37.59,22.22 37.47,22.35 32.89,22.35 32,23.24 32,29.97 v32.13,30.1
VS  (via drill 0.8)
  Top 0.61: v35.43,18.8 35.43,19.81 C9.1
  Top 0.813: D6.C D5.C D4.C D3.C 75.07,45.47 v81.79,45.47 | IC2.2 38.38,16.23 v38.35,16.26
  Top 1.27: U$3.TIP 21.85,15.96 C8.+
  Bottom 0.61: v38.35,16.26 38.35,19.81 37.72,20.45 35.94,20.45 35.43,19.94 v35.43,18.8
  Bottom 0.813: v38.35,16.26 34.42,16.26 32.64,14.48 32.64,9.14 J1.2 33.91,7.87 33.91,6.35 35.31,4.95 78.99,4.95 81.79,7.75 v81.79,45.47 81.79,54.61 78.23,58.17 78.23,59.44 77.47,60.2 64.64,60.2 63.5,59.05 IC1.4
  Bottom 1.27: J1.2 19.42,8.26 U$3.TIP
(copper drawn outside any net)
  shapes: Top area x2